# EAGLE design HC05_shield (EAGLE 7.4.0)
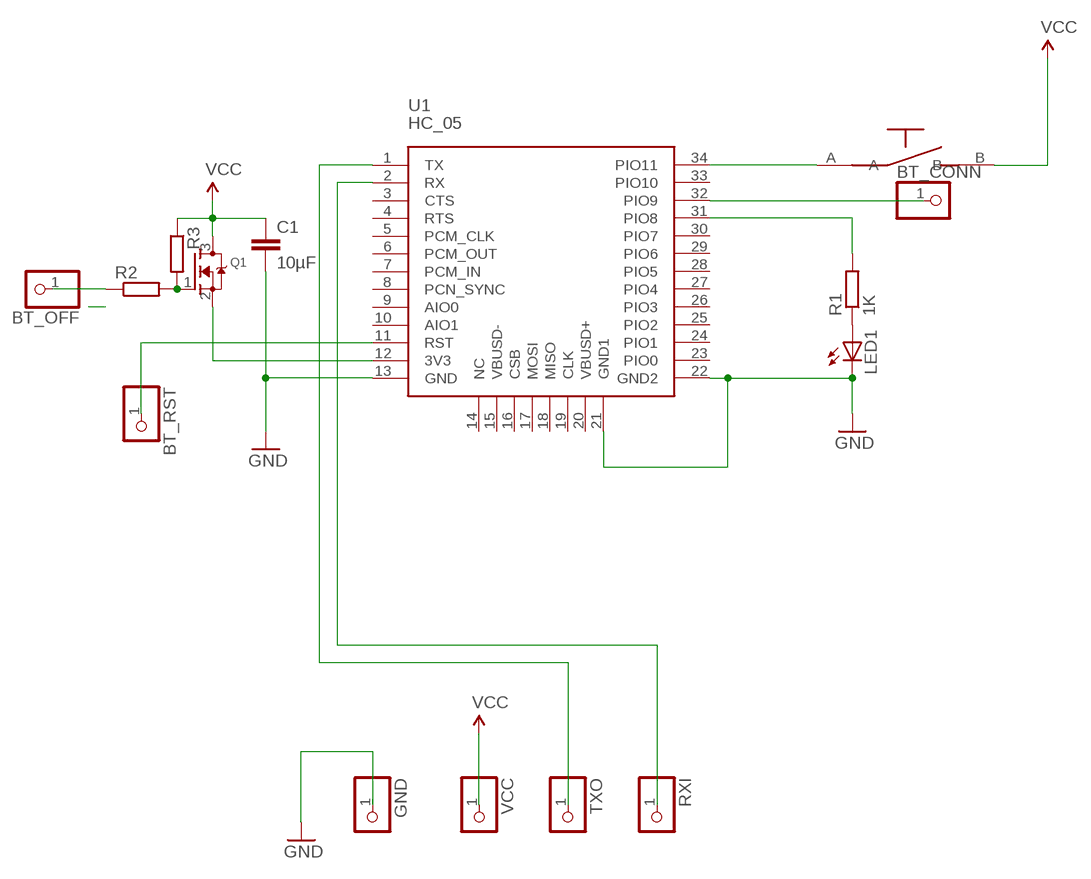
[diagram p0: schematic, sheet 1]

## Parts
BT_CONN  PINHD-1X1  [1X01]
BT_OFF  PINHD-1X1  [1X01]
BT_RST  PINHD-1X1  [1X01]
C1  10µF  C-EUC0805  [C0805]
GND  PINHD-1X1  [1X01]
LED1  LEDCHIP-LED0805  [CHIP-LED0805]
Q1  MOSFET-NREFLOW  [SOT23]
R1  1K  R-EU_R0805  [R0805]
R2  R-EU_R0603  [R0603]
R3  R-EU_R0603  [R0603]
RXI  PINHD-1X1  [1X01]
TXO  PINHD-1X1  [1X01]
U1  HC_05  [BLUETOOTH_SMD]
U$2  SWITCH2PIN  [SWITCH2PIN]
VCC  PINHD-1X1  [1X01]

## Nets
BT_RST: BT_RST.1 U1.11(RST)
GND: C1.2 GND.1 LED1.C U1.13(GND) U1.21(GND1) U1.22(GND2)
N$1: U1.34(PIO11) U$2.A
N$2: Q1.1(G) R2.2 R3.2
N$3: LED1.A R1.1
N$4: TXO.1 U1.1(TX)
N$5: RXI.1 U1.2(RX)
N$6: BT_CONN.1 U1.32(PIO9)
N$8: R1.2 U1.31(PIO8)
N$9: Q1.2(S) U1.12(3V3)
N$11: BT_OFF.1 R2.1
VCC: C1.1 Q1.3(D) R3.1 U$2.B VCC.1
Unconnected: U1.3(CTS) U1.4(RTS) U1.5(PCM_CLK) U1.6(PCM_OUT) U1.7(PCM_IN) U1.8(PCN_SYNC) U1.9(AIO0) U1.10(AIO1) U1.14(NC) U1.15(VBUSD-) U1.16(CSB) U1.17(MOSI) U1.18(MISO) U1.19(CLK) U1.20(VBUSD+) U1.23(PIO0) U1.24(PIO1) U1.25(PIO2) U1.26(PIO3) U1.27(PIO4) U1.28(PIO5) U1.29(PIO6) U1.30(PIO7) U1.33(PIO10)

## Library data of the parts
BT_CONN BT_OFF BT_RST GND RXI TXO VCC = adafruit:PINHD-1X1: Pin header 1x1 for 0.1" spacing With round pins
C1 = rcl:C-EU: CAPACITOR, European symbol
LED1 = led:LED: LED OSRAM: - CHIPLED LG R971, LG N971, LY N971, LG Q971, LY Q971, LO R971, LY R971 LH N974, LH R974 LS Q976, LO Q976, LY Q976 LO Q996 - Hyper CHIPLED LW Q18S LB Q993, LB Q99A, LB R99A - SideLED LS A670, LO A670, LY A670, LG A670, LP A670 LB A673, LV A673, LT A673, LW A673 LH A674 LY A675 LS A676, LA A676, LO A676, LY A676, LW A676 LS A679, LY A679, LG A679 - Hyper Micro SIDELED® LS Y876, LA Y876, LO Y876, LY Y876 LT Y87S - SmartLED LW L88C, LW L88S LB L89C, LB L89S, LG L890 LS L89K, LO L89K, LY L89K LS L896, LA L896, LO L896, LY L896 - TOPLED LS T670, LO T670, LY T670, LG T670, LP T670 LSG T670, LSP T670, LSY T670, LOP T670, LYG T670 LG T671, LOG T671, LSG T671 LB T673, LV T673, LT T673, LW T673 LH T674 LS T676, LA T676, LO T676, LY T676, LB T676, LH T676, LSB T676, LW T676 LB T67C, LV T67C, LT T67C, LS T67K, LO T67K, LY T67K, LW E67C LS E67B, LA E67B, LO E67B, LY E67B, LB E67C, LV E67C, LT E67C LW T67C LS T679, LY T679, LG T679 LS T770, LO T770, LY T770, LG T770, LP T770 LB T773, LV T773, LT T773, LW T773 LH T774 LS E675, LA E675, LY E675, LS T675 LS T776, LA T776, LO T776, LY T776, LB T776 LHGB T686 LT T68C, LB T68C - Hyper Mini TOPLED® LB M676 - Mini TOPLED Santana® LG M470 LS M47K, LO M47K, LY M47K Source: http://www.osram.convergy.de LUXEON: - LUMILED® LXK2-PW12-R00, LXK2-PW12-S00, LXK2-PW14-U00, LXK2-PW14-V00 LXK2-PM12-R00, LXK2-PM12-S00, LXK2-PM14-U00 LXK2-PE12-Q00, LXK2-PE12-R00, LXK2-PE12-S00, LXK2-PE14-T00, LXK2-PE14-U00 LXK2-PB12-K00, LXK2-PB12-L00, LXK2-PB12-M00, LXK2-PB14-N00, LXK2-PB14-P00, LXK2-PB14-Q00 LXK2-PR12-L00, LXK2-PR12-M00, LXK2-PR14-Q00, LXK2-PR14-R00 LXK2-PD12-Q00, LXK2-PD12-R00, LXK2-PD12-S00 LXK2-PH12-R00, LXK2-PH12-S00 LXK2-PL12-P00, LXK2-PL12-Q00, LXK2-PL12-R00 Source: www.luxeon.com KINGBRIGHT: KA-3528ASYC Source: www.kingbright.com
Q1 = adafruit:MOSFET-N: N-Channel Mosfet 2N7002E - 60V 260mA SOT23 [Digikey: 2N7002ET1GOSTR-ND] - REEL BSH103 - 30V 850mA SOT23 [Digikey: 568-5013-1-ND]
R1-R3 = rcl:R-EU_: RESISTOR, European symbol
U1 = SerialPortBluetooth:HC_05
U$2 = switch2pin:SWITCH2PIN

## Board
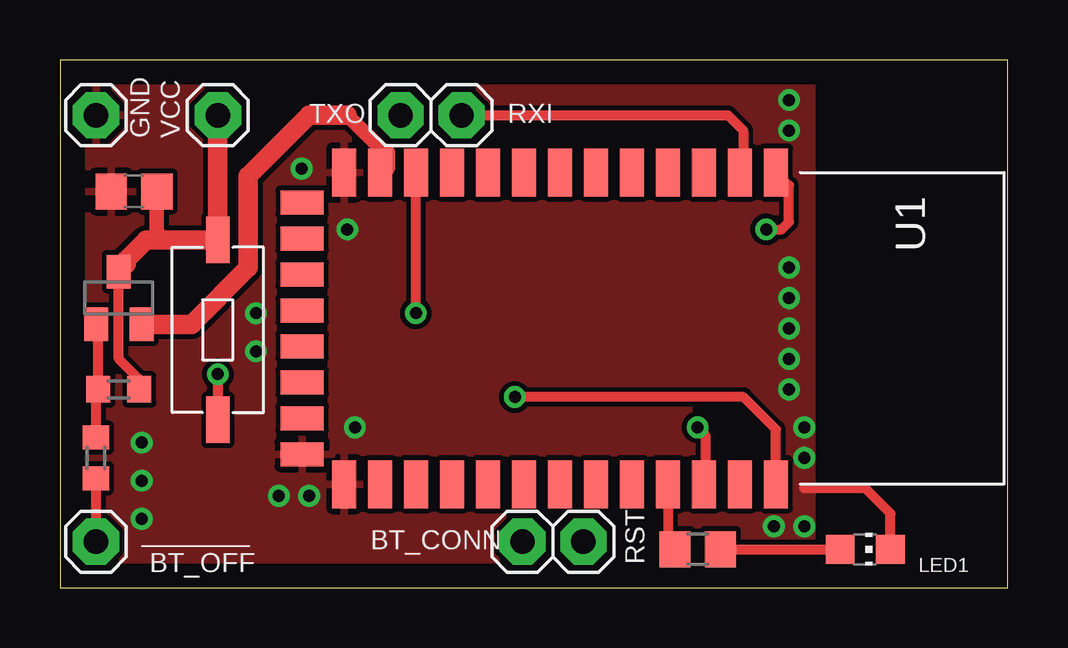
[diagram p1: board, top side]
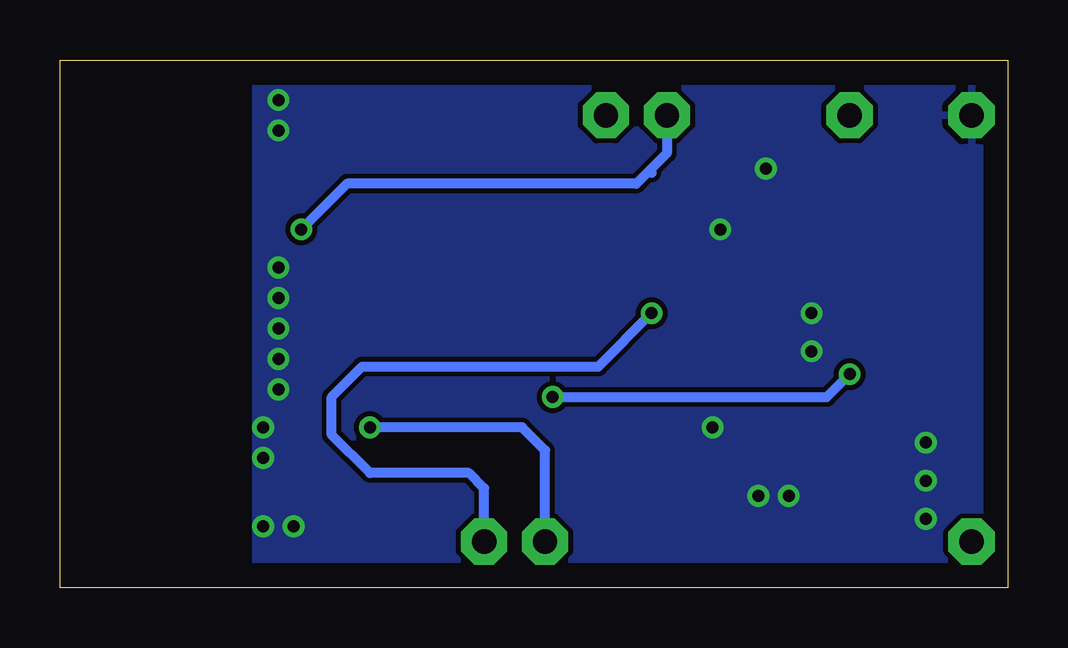
[diagram p2: board, bottom side, seen from below]

Size 39.5 x 22 mm. Coordinates in mm from the lower left corner, seen from the top.
Outline: 0,0 39.5,0 39.5,22 0,22 0,0
Copper layers (1*16): Top 0.035mm / dielectric 1.5mm / Bottom 0.035mm
Design rules "default *": minimum track width 10mil, minimum drill 24mil, track to track 8mil, track to pad 8mil, pad to pad 8mil, via to via 8mil, smd to smd 8mil, copper to edge 40mil, drill to drill 8mil, minimum pad ring 10mil, minimum via ring 8mil, stop-mask expansion 4mil, vias tented up to drill 20mil, thermal gap 10mil

### Footprints (pad centres in the part's own frame; a part is rotated, then mirrored left to right if it is on the bottom)
1X01 = drill 1.016 pad 1.93 octagon: 1 0,0
C0805 = smd 1.3 x 1.5: 1 -0.95,0; 2 0.95,0
CHIP-LED0805 = smd 1.2 x 1.2: A 0,-1.05; C 0,1.05
SOT23 = smd 1 x 1.4: 1 -0.95,-1.1; 2 0.95,-1.1; 3 0,1.1
R0805 = smd 1.3 x 1.5: 1 -0.95,0; 2 0.95,0
R0603 = smd 1 x 1.1: 1 -0.85,0; 2 0.85,0
BLUETOOTH_SMD = smd 2 x 1: 1 0,0; 2 0,-1.5; 3 0,-3; 4 0,-4.5; 5 0,-6; 6 0,-7.5; 7 0,-9; 8 0,-10.5; 9 0,-12; 10 0,-13.5; 11 0,-15; 12 0,-16.5; 13 0,-18; 22 13,-18; 23 13,-16.5; 24 13,-15; 25 13,-13.5; 26 13,-12; 27 13,-10.5; 28 13,-9; 29 13,-7.5; 30 13,-6; 31 13,-4.5; 32 13,-3; 33 13,-1.5; 34 13,0 | smd 1 x 1.8: 14 1.25,-19.75; 15 2.75,-19.75; 16 4.25,-19.75; 17 5.75,-19.75; 18 7.25,-19.75; 19 8.75,-19.75; 20 10.25,-19.75; 21 11.75,-19.75
SWITCH2PIN = smd 1.93 x 0.965: A 0,0; B 7.5,0

### Placement (x,y rotation side)
BT_CONN  19.28,1.92 0 top
BT_OFF  1.5,1.92 0 top
BT_RST  21.82,1.92 0 top
C1  3.09,16.52 180 top
GND  1.5,19.7 0 top
LED1  33.57,1.6 270 top
Q1  2.45,12.07 0 top
R1  26.58,1.6 180 top
R2  1.5,5.41 90 top
R3  2.45,8.27 180 top
RXI  16.74,19.7 0 top
TXO  14.2,19.7 0 top
U1  29.85,17.31 270 top
U$2  6.58,7 90 top
VCC  6.58,19.7 0 top

### Tracks (layer width: path | path; a pad name or v marks a point on that pad's centre or on a via)
BT_RST  (via drill 0.5)  (1 unrouted)
  Top 0.406: v14.84,11.44 14.84,17.3 U1.11
  Bottom 0.406: BT_RST.1 21.82,4.14 22.45,4.77 26.58,4.77 28.17,6.36 28.17,7.95 26.9,9.22 17.06,9.22 v14.84,11.44 | 14.84,17.3 U1.11
GND  (via drill 0.5)
  Top 0.406: LED1.C 34.62,3.09 33.57,4.14 31.03,4.14
  other vias: 30.39,8.27 30.39,9.54 30.39,10.8 30.39,12.07 30.39,13.35 30.39,19.06 30.39,20.33 31.03,6.68 31.03,5.41 31.03,2.55 29.76,2.55 3.41,6.04 3.41,4.46 3.41,2.87 8.17,11.44 8.17,9.85 10.07,17.47 10.39,3.82 9.12,3.82 11.98,14.93 12.29,6.68
  pour Bottom: -2.31,25.41 -2.31,-2.53 31.34,-2.21 31.34,25.73
  pour Top: -3.58,24.14 -3.58,-1.26 31.34,-1.26 31.34,24.14
N$1  (via drill 0.5)
  Top 0.406: U1.34 29.85,6.59 28.49,7.95 v18.96,7.95 | v6.58,8.9 U$2.A
  Bottom 0.406: v18.96,7.95 7.53,7.95 v6.58,8.9
N$2
  Top 0.406: R2.2 1.5,8.16 R3.2 1.6,10.88 Q1.1
N$3
  Top 0.406: R1.1 LED1.A
N$4  (via drill 0.5)
  Top 0.406: v29.44,14.93 30.07,14.93 30.39,15.25 30.39,16.77 U1.1
  Bottom 0.406: TXO.1 14.2,18.11 15.47,16.84 27.54,16.84 v29.44,14.93
N$5
  Top 0.406: RXI.1 27.85,19.7 28.49,19.06 28.49,17.45 U1.2
N$6  (via drill 0.5)
  Top 0.406: v26.58,6.68 26.9,6.36 26.9,4.37 U1.32
  Bottom 0.406: BT_CONN.1 19.28,5.72 20.23,6.68 v26.58,6.68
N$8
  Top 0.406: U1.31 25.35,1.88 R1.2
N$9
  Top 0.61: 11.98,19.7 13.56,18.11
  Top 0.813: Q1.2 5.48,10.97 7.85,13.35 7.85,17.16 10.39,19.7 11.98,19.7 | 13.56,18.11 13.56,17.53 U1.12
N$11
  Top 0.406: BT_OFF.1 R2.1
VCC
  Top 0.406: R3.1 3.3,8.69 2.45,9.54 Q1.3
  Top 0.61: C1.1 4.04,14.81 4.36,14.49
  Top 0.813: VCC.1 U$2.B 4.36,14.49 3.6,14.49 2.77,13.66 2.77,13.49 Q1.3

### Text on the board
tPlace: TXO | RXI | GND | VCC | _______ | BT_CONN | RST | BT_OFF